# Altium project AnotherReprapController.PrjPcb
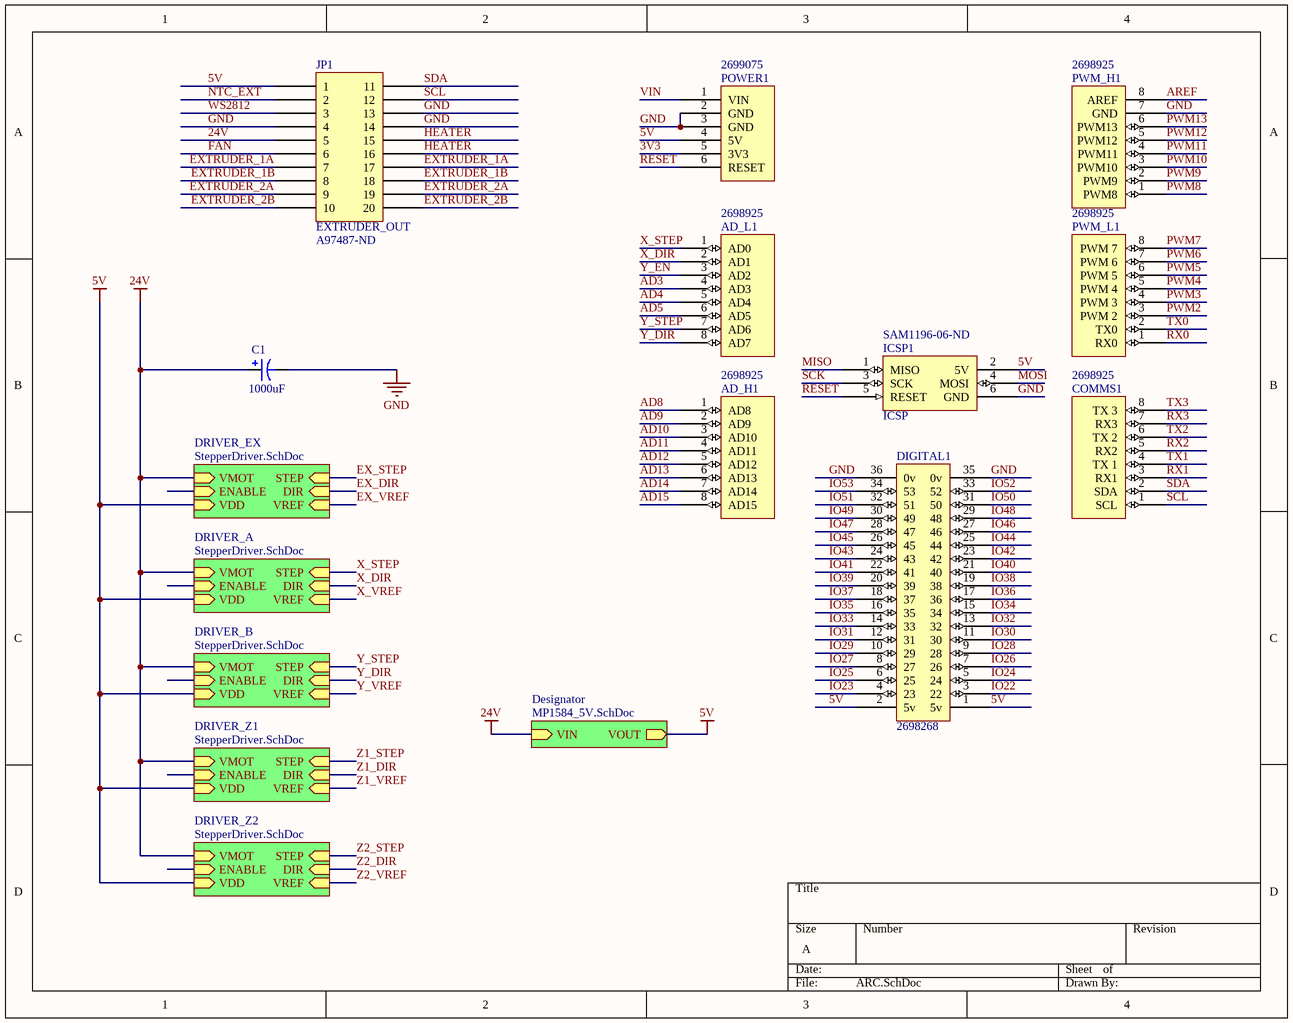
[diagram p0: ARC.SchDoc]
3 sheets, 47 parts. Net scope: hierarchical (ports join the sheet entries above them; power ports are global).
Board file: ARC.PcbDoc
Sheets:
  ARC.SchDoc
    DRIVER_EX = StepperDriver.SchDoc
    DRIVER_A = StepperDriver.SchDoc
    DRIVER_Z1 = StepperDriver.SchDoc
    DRIVER_B = StepperDriver.SchDoc
    DRIVER_Z2 = StepperDriver.SchDoc
    Designator = MP1584_5V.SchDoc

## Sheet ARC.SchDoc
size A

### Parts
AD_H1  Supplier Part Number 4: 2698925  [Header 8x1 8.5mm]  (hidden comment: AD_H)
AD_L1  Supplier Part Number 5: 2698925  [Header 8x1 8.5mm]  (hidden comment: AD_L)
C1  1000uF  [CAP_12.5mm]
COMMS1  Supplier Part Number 4: 2698925  [Header 8x1 8.5mm]  (hidden comment: Communication)
DIGITAL1  Supplier Part Number 5: 2698268  [HEADER 36X 8MM]  (hidden comment: IO_36)
ICSP1  ICSP  Supplier Part Number 5: SAM1196-06-ND  [ICSP]
JP1  EXTRUDER_OUT  Supplier Part Number 1: A97487-ND  [IDC20]
POWER1  Supplier Part Number 2: 2699075  [Header 6x1 8.5mm]  (hidden comment: POWER)
PWM_H1  Supplier Part Number 4: 2698925  [Header 8x1 8.5mm]  (hidden comment: PWM_H)
PWM_L1  Supplier Part Number 4: 2698925  [Header 8x1 8.5mm]  (hidden comment: PWM_L)

### Sub-sheets
Designator = MP1584_5V.SchDoc: VIN (in), VOUT (out)
DRIVER_A = StepperDriver.SchDoc: VMOT (in), VDD (in), STEP (in), DIR (in), VREF (in), ENABLE (in)
DRIVER_B = StepperDriver.SchDoc: VMOT (in), VDD (in), STEP (in), DIR (in), VREF (in), ENABLE (in)
DRIVER_EX = StepperDriver.SchDoc: VMOT (in), VDD (in), STEP (in), DIR (in), VREF (in), ENABLE (in)
DRIVER_Z1 = StepperDriver.SchDoc: VMOT (in), VDD (in), STEP (in), DIR (in), VREF (in), ENABLE (in)
DRIVER_Z2 = StepperDriver.SchDoc: VMOT (in), VDD (in), STEP (in), DIR (in), VREF (in), ENABLE (in)

### Nets
5V: DIGITAL1.1(5v) DIGITAL1.2(5v) ICSP1.2(5V) JP1.1 POWER1.4(5V) ; sheet DRIVER_EX/VDD, sheet DRIVER_A/VDD, sheet DRIVER_Z1/VDD, sheet DRIVER_B/VDD, sheet DRIVER_Z2/VDD, sheet Designator/VOUT
24V: C1.0 JP1.5 ; sheet DRIVER_EX/VMOT, sheet DRIVER_A/VMOT, sheet DRIVER_Z1/VMOT, sheet DRIVER_B/VMOT, sheet DRIVER_Z2/VMOT, sheet Designator/VIN
GND: C1.1 DIGITAL1.35(0v) DIGITAL1.36(0v) ICSP1.6(GND) JP1.4 JP1.13 JP1.14 POWER1.2(GND) POWER1.3(GND) PWM_H1.7(GND)
3V3: POWER1.5(3V3)
AD3: AD_L1.4(AD3)
AD4: AD_L1.5(AD4)
AD5: AD_L1.6(AD5)
AD8: AD_H1.1(AD8)
AD9: AD_H1.2(AD9)
AD10: AD_H1.3(AD10)
AD11: AD_H1.4(AD11)
AD12: AD_H1.5(AD12)
AD13: AD_H1.6(AD13)
AD14: AD_H1.7(AD14)
AD15: AD_H1.8(AD15)
AREF: PWM_H1.8(AREF)
EXTRUDER_1A: JP1.7 JP1.17
EXTRUDER_1B: JP1.8 JP1.18
EXTRUDER_2A: JP1.9 JP1.19
EXTRUDER_2B: JP1.10 JP1.20
FAN: JP1.6
HEATER: JP1.15 JP1.16
IO22: DIGITAL1.3(22)
IO23: DIGITAL1.4(23)
IO24: DIGITAL1.5(24)
IO25: DIGITAL1.6(25)
IO26: DIGITAL1.7(26)
IO27: DIGITAL1.8(27)
IO28: DIGITAL1.9(28)
IO29: DIGITAL1.10(29)
IO30: DIGITAL1.11(30)
IO31: DIGITAL1.12(31)
IO32: DIGITAL1.13(32)
IO33: DIGITAL1.14(33)
IO34: DIGITAL1.15(34)
IO35: DIGITAL1.16(35)
IO36: DIGITAL1.17(36)
IO37: DIGITAL1.18(37)
IO38: DIGITAL1.19(38)
IO39: DIGITAL1.20(39)
IO40: DIGITAL1.21(40)
IO41: DIGITAL1.22(41)
IO42: DIGITAL1.23(42)
IO43: DIGITAL1.24(43)
IO44: DIGITAL1.25(44)
IO45: DIGITAL1.26(45)
IO46: DIGITAL1.27(46)
IO47: DIGITAL1.28(47)
IO48: DIGITAL1.29(48)
IO49: DIGITAL1.30(49)
IO50: DIGITAL1.31(50)
IO51: DIGITAL1.32(51)
IO52: DIGITAL1.33(52)
IO53: DIGITAL1.34(53)
MISO: ICSP1.1(MISO)
MOSI: ICSP1.4(MOSI)
NTC_EXT: JP1.2
PWM2: PWM_L1.3(PWM_2)
PWM3: PWM_L1.4(PWM_3)
PWM4: PWM_L1.5(PWM_4)
PWM5: PWM_L1.6(PWM_5)
PWM6: PWM_L1.7(PWM_6)
PWM7: PWM_L1.8(PWM_7)
PWM8: PWM_H1.1(PWM8)
PWM9: PWM_H1.2(PWM9)
PWM10: PWM_H1.3(PWM10)
PWM11: PWM_H1.4(PWM11)
PWM12: PWM_H1.5(PWM12)
PWM13: PWM_H1.6(PWM13)
RESET: ICSP1.5(RESET) POWER1.6(RESET)
RX0: PWM_L1.1(RX0)
RX1: COMMS1.3(RX1)
RX2: COMMS1.5(RX2)
RX3: COMMS1.7(RX3)
SCK: ICSP1.3(SCK)
SCL: COMMS1.1(SCL) JP1.12
SDA: COMMS1.2(SDA) JP1.11
TX0: PWM_L1.2(TX0)
TX1: COMMS1.4(TX_1)
TX2: COMMS1.6(TX_2)
TX3: COMMS1.8(TX_3)
VIN: POWER1.1(VIN)
WS2812: JP1.3
X_DIR: AD_L1.2(AD1) ; sheet DRIVER_A/DIR
X_STEP: AD_L1.1(AD0) ; sheet DRIVER_A/STEP
Y_DIR: AD_L1.8(AD7) ; sheet DRIVER_B/DIR
Y_EN: AD_L1.3(AD2)
Y_STEP: AD_L1.7(AD6) ; sheet DRIVER_B/STEP

### Library data of the parts
C1 = CAP_12.5MM_GENERIC: Generic electrolytic capacitor w/ 12.5mm diameter and 5mm pitch
JP1 = IDC20: Supplier 1: Digi-Key
AD_H1 = AD_H: Supplier 1: Arrow; Supplier Part Number 1: 2698940; Supplier 2: Arrow; Supplier Part Number 2: 2698939; Supplier 3: Digi-Key; Supplier Part Number 3: SAM1198-08-ND; Supplier 4: Arrow
AD_L1 = AD_L: Supplier 1: Digi-Key; Supplier Part Number 1: SAM1198-08-ND; Supplier 2: Arrow; Supplier Part Number 2: 2698939; Supplier 3: Arrow; Supplier Part Number 3: 2698940; Supplier 4: Arrow; Supplier Part Number 4: 43085273; Supplier 5: Arrow
COMMS1 = Communication: Supplier 1: Digi-Key; Supplier Part Number 1: SAM1198-08-ND; Supplier 2: Arrow; Supplier Part Number 2: 2698940; Supplier 3: Arrow; Supplier Part Number 3: 2698939; Supplier 4: Arrow
DIGITAL1 = IO_36: Supplier 1: Digi-Key; Supplier Part Number 1: SAM1196-18-ND; Supplier 2: Arrow; Supplier Part Number 2: 48117090; Supplier 3: Arrow; Supplier Part Number 3: 46093326; Supplier 4: Arrow; Supplier Part Number 4: 2698278; Supplier 5: Arrow
ICSP1 = ICSP: Supplier 1: Digi-Key; Supplier Part Number 1: SAM1185-06-ND; Supplier 2: Arrow; Supplier Part Number 2: 2699117; Supplier 3: Arrow; Supplier Part Number 3: 43862781; Supplier 4: Arrow; Supplier Part Number 4: 2699091; Supplier 5: Digi-Key
POWER1 = POWER: Supplier 1: Arrow; Supplier Part Number 1: 52553843; Supplier 2: Arrow; Supplier 3: Digi-Key; Supplier Part Number 3: SAM1198-06-ND; Supplier 4: Arrow; Supplier Part Number 4: 2699089; Supplier 5: Arrow; Supplier Part Number 5: 2699088
PWM_H1 = PWM_H: Supplier 1: Digi-Key; Supplier Part Number 1: SAM1198-08-ND; Supplier 2: Arrow; Supplier Part Number 2: 2698940; Supplier 3: Arrow; Supplier Part Number 3: 2698939; Supplier 4: Arrow
PWM_L1 = PWM_L: Supplier 1: Arrow; Supplier Part Number 1: 2698940; Supplier 2: Arrow; Supplier Part Number 2: 2698939; Supplier 3: Digi-Key; Supplier Part Number 3: SAM1198-08-ND; Supplier 4: Arrow

## Sheet StepperDriver.SchDoc
size A
Used 5 times, as channels DRIVER_EX, DRIVER_A, DRIVER_Z1, DRIVER_B, DRIVER_Z2. Parts and nets are listed once, with the designators drawn on the sheet.
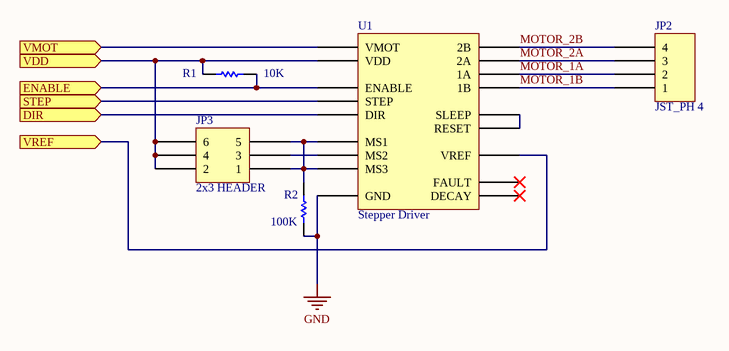
[diagram p1: StepperDriver.SchDoc]

### Parts
JP2  JST_PH 4  [JST_PH 4]
JP3  2x3 HEADER  [2x3 HEADER]
R1  10K  [RESC0603(1608)_N]
R2  100K  [RESC0603(1608)_N]
U1  Stepper Driver  [SureStepr]

### Ports
DIR (in), ENABLE (in), STEP (in), VDD (in), VMOT (in), VREF (in)

### Nets
GND: R2.1 U1.GND
DIR: U1.DIR ; port DIR
ENABLE: R1.1 U1.ENABLE ; port ENABLE
MOTOR_1A: JP2.2 U1.1A
MOTOR_1B: JP2.1 U1.1B
MOTOR_2A: JP2.3 U1.2A
MOTOR_2B: JP2.4 U1.2B
STEP: U1.STEP ; port STEP
VDD: JP3.2 JP3.4 JP3.6 R1.2 U1.VDD ; port VDD
VMOT: U1.VMOT ; port VMOT
VREF: U1.VREF ; port VREF
NetJP3_1: JP3.1 JP3.5 R2.2 U1.MS1 U1.MS3
NetJP3_3: JP3.3 U1.MS2
NetU1_RESET: U1.RESET U1.SLEEP

Not connected (* = marked no-connect by the designer): U1 DECAY* FAULT*

### Channels
DRIVER_EX: designators JP2=JP3_DRIVER_EX JP3=JP2_DRIVER_EX R1=R1_DRIVER_EX R2=R2_DRIVER_EX U1=U1_DRIVER_EX; ports DIR=EX_DIR ENABLE=NetR1_DRIVER_EX_1 STEP=EX_STEP VDD=5V VMOT=24V VREF=EX_VREF
DRIVER_A: designators JP2=JP3_DRIVER_A JP3=JP2_DRIVER_A R1=R1_DRIVER_A R2=R2_DRIVER_A U1=U1_DRIVER_A; ports DIR=X_DIR ENABLE=NetR1_DRIVER_A_1 STEP=X_STEP VDD=5V VMOT=24V VREF=X_VREF
DRIVER_Z1: designators JP2=JP3_DRIVER_Z1 JP3=JP2_DRIVER_Z1 R1=R1_DRIVER_Z1 R2=R2_DRIVER_Z1 U1=U1_DRIVER_Z1; ports DIR=Z1_DIR ENABLE=NetR1_DRIVER_Z1_1 STEP=Z1_STEP VDD=5V VMOT=24V VREF=Z1_VREF
DRIVER_B: designators JP2=JP3_DRIVER_B JP3=JP2_DRIVER_B R1=R1_DRIVER_B R2=R2_DRIVER_B U1=U1_DRIVER_B; ports DIR=Y_DIR ENABLE=NetR1_DRIVER_B_1 STEP=Y_STEP VDD=5V VMOT=24V VREF=Y_VREF
DRIVER_Z2: designators JP2=JP3_DRIVER_Z2 JP3=JP2_DRIVER_Z2 R1=R1_DRIVER_Z2 R2=R2_DRIVER_Z2 U1=U1_DRIVER_Z2; ports DIR=Z2_DIR ENABLE=NetR1_DRIVER_Z2_1 STEP=Z2_STEP VDD=5V VMOT=24V VREF=Z2_VREF

### Library data of the parts
R1 = CMP-1012-00098-1: 10K 0.1W 5% 0603 (1608 Metric)  SMD; Case-EIA: 0603; Value: 10000.00 Ohm; Case-Metric: 1608; Technology: SMT; Tolerance: 5 %; Power: 0.1 W
R2 = CMP-1012-00122-1: 100K 0.1W 5% 0603 (1608 Metric)  SMD; Case-EIA: 0603; Value: 100000.00 Ohm; Case-Metric: 1608; Tolerance: 5 %; Power: 0.1 W; Technology: SMT

## Sheet MP1584_5V.SchDoc
size A
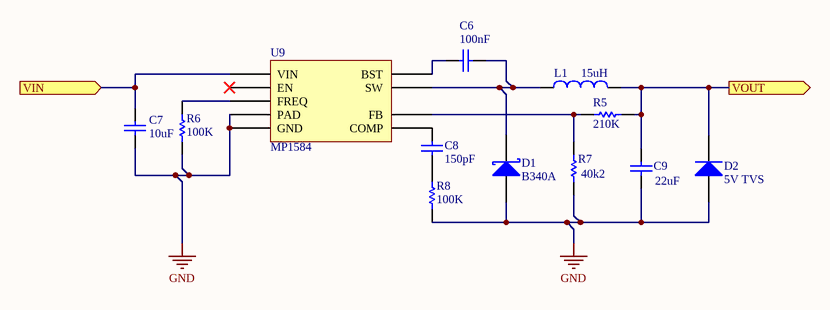
[diagram p2: MP1584_5V.SchDoc]

### Parts
C6  100nF  [CAPC0603(1608)100_L]
C7  10uF  [CAPC1210(3225)280_L]
C8  150pF  [CAPC0603(1608)100_L]
C9  22uF  [CAPC1210(3225)170_L]
D1  B340A  [DIOD-SMA-2_V]
D2  5V TVS  [VISH-DO-214AC-2_M]
L1  value 15uH  [0630 Inductor]  (hidden comment: 0630 Inductor)
R5  210K  [RESC0603(1608)_L]
R6  100K  [RESC0603(1608)_L]
R7  40k2  [RESC0603(1608)_L]
R8  100K  [RESC0603(1608)_L]
U9  MP1584  [SOIC8E]

### Ports
VIN (in), VOUT (out)

### Nets
5V: C9.2 D2.1(K) L1.2 R5.2 ; port VOUT
24V: C7.2 U9.7(VIN) ; port VIN
GND: C7.1 C9.1 D1.1(A) D2.2(A) R6.1 R7.1 R8.1 U9.5(GND) U9.9(PAD)
NetC6_1: C6.1 U9.8(BST)
NetC6_2: C6.2 D1.2(K) L1.1 U9.1(SW)
NetC8_1: C8.1 R8.2
NetC8_2: C8.2 U9.3(COMP)
NetR5_1: R5.1 R7.2 U9.4(FB)
NetR6_2: R6.2 U9.6(FREQ)

Not connected (* = marked no-connect by the designer): U9 2(EN)*

### Library data of the parts
C6 = CMP-1035-02591-1: CAP 100nF 50V ±5% 0603 (1608 Metric) Thickness 1mm SMD; Tolerance: Â±5%; Case-Metric: 1608; Case-EIA: 0603; Rated Voltage: 50 V; Max Thickness: 1 mm; Technology: SMT; Value: 100nF
C7 = CMP-1038-02234-1: CAP 10uF 35V ±10% 1210 (3225 Metric) Thickness 2.8mm SMD; Case-Metric: 3225; Case-EIA: 1210; Tolerance: Â±10%; Rated Voltage: 35 V; Value: 10uF; Max Thickness: 2.8 mm; Technology: SMT
C8 = CMP-1035-01367-1: CAP 150pF 50V ±5% 0603 (1608 Metric) Thickness 1mm SMD; Case-Metric: 1608; Tolerance: Â±5%; Case-EIA: 0603; Technology: SMT; Rated Voltage: 50 V; Value: 150pF; Max Thickness: 1 mm
C9 = CMP-1038-02258-1: CAP 22uF 6.3V ±10% 1210 (3225 Metric) Thickness 1.7mm SMD; Case-Metric: 3225; Tolerance: Â±10%; Case-EIA: 1210; Value: 22uF; Rated Voltage: 6.3 V; Technology: SMT; Max Thickness: 1.7 mm
D1 = CMP-1667-00003-1: Surface Mount Schottky Barrier Rectifier, 40 V, 3 A, -55 to 150 degC, 2-Pin SMA, RoHS, Tape and Reel; Forward Current: 3 A; Forward Voltage: 500 mV; Max Surge Current: 80 A; Peak Reverse Current: 500 uA; Elements: 1; Mounting Technology: Surface Mount; ComponentLink1URL: http://www.diodes.com/; PackageDescription: 2-Pin Surface Mounted Assembly, Body 4.3 x 2.605 mm, Height 2.4 mm; Min Operating Temperature: -55 degC; Mount: Surface Mount; Pins: 2; ComponentLink2URL: http://www.diodes.com/_files/datasheets/ds30891.pdf; PackageReference: SMA-2; Max Operating Temperature: 125 degC; Radiation Hardening: No; Length: 4.6 mm; RoHSCompliant: true; ComponentLink1Description: Manufacturer URL; Height: 2.1 mm; ComponentLink2Description: Datasheet; Packaging: Tape and Reel; Package Quantity: 5000; Case\Package: SMA; DatasheetVersion: Rev. 17 - 2, 09/2015; REACH SVHC: No SVHC; Width: 2.92 mm
D2 = CMP-0548-00062-2: Transient Voltage Suppressor, 6.40 to 231 V, 5 V Stand-off Voltage, Uni-Directional, -55 to 155 degC, 2-pin DO-214AC, Pb-Free, Tape and Reel; Manufacturer: Vishay Semiconductor; PartNumber: SMAJ5.0AHE3/61; ID (uA): 800; VBR Uni-Directional (V): 6.4 to 231; IFSM: 40 A; VWM (V): 5; PPPM (W): 400, 300; DatasheetVersion: 12/8/2013; ComponentLink3URL: http://www.vishay.com/docs/88390/smaj50a.pdf; ComponentLink2URL: http://www.vishay.com/docs/88390/smaj50a.pdf; PackageDescription: 2-Pin DO-214AC (SMA), Body 4.245 x 2.665 mm; ComponentLink3Description: Package Specification; RoHS: TRUE; Operating Junction and Storage Temperature Range: -55 to 150 degC; ComponentLink2Description: Datasheet; Mounting Technology: Surface Mount; Packing: Tape and Reel; PackageReference: DO-214AC-2; ComponentLink1Description: Manufacturer URL; ComponentLink1URL: http://www.vishay.com/
L1 = PCC-M0630M: Code_IEC: 1005; Published: 8-Jun-2000; LatestRevisionDate: 29-May-2009; LatestRevisionNote: IPC-7351 Footprint Added.; PackageReference: 0402-A; Publisher: Altium Limited; PackageDescription: Chip Inductor; Code_JEITA: 0402
R5 = CMP-1012-00770-1: 210K 0.1W 1% 0603 (1608 Metric)  SMD; Case-Metric: 1608; Value: 210000.00 Ohm; Case-EIA: 0603; Technology: SMT; Power: 0.1 W; Tolerance: 1 %
R6 R8 = CMP-1012-00122-1: as R2 on sheet StepperDriver; Tolerance: 5 %; Power: 0.1 W; Technology: SMT
R7 = CMP-1012-00691-1: 40K2 0.1W 1% 0603 (1608 Metric)  SMD; Case-Metric: 1608; Value: 40200.00 Ohm; Case-EIA: 0603; Tolerance: 1 %; Technology: SMT; Power: 0.1 W
U9 = MP1584: MP1584 3A, 1.5MHz, 28V Step-Down Converter

## Nets that join several sheets
5V: ARC (5 pins), DRIVER_EX (5 pins), DRIVER_A (5 pins), DRIVER_Z1 (5 pins), DRIVER_B (5 pins), DRIVER_Z2 (5 pins), MP1584_5V (C9.2 D2.1 L1.2 R5.2)
24V: ARC (C1.0 JP1.5), DRIVER_EX (U1_DRIVER_EX.VMOT), DRIVER_A (U1_DRIVER_A.VMOT), DRIVER_Z1 (U1_DRIVER_Z1.VMOT), DRIVER_B (U1_DRIVER_B.VMOT), DRIVER_Z2 (U1_DRIVER_Z2.VMOT), MP1584_5V (C7.2 U9.7)
GND: ARC (10 pins), DRIVER_EX (R2_DRIVER_EX.1 U1_DRIVER_EX.GND), DRIVER_A (R2_DRIVER_A.1 U1_DRIVER_A.GND), DRIVER_Z1 (R2_DRIVER_Z1.1 U1_DRIVER_Z1.GND), DRIVER_B (R2_DRIVER_B.1 U1_DRIVER_B.GND), DRIVER_Z2 (R2_DRIVER_Z2.1 U1_DRIVER_Z2.GND), MP1584_5V (9 pins)
X_DIR: ARC (AD_L1.2), DRIVER_A (U1_DRIVER_A.DIR)
X_STEP: ARC (AD_L1.1), DRIVER_A (U1_DRIVER_A.STEP)
Y_DIR: ARC (AD_L1.8), DRIVER_B (U1_DRIVER_B.DIR)
Y_STEP: ARC (AD_L1.7), DRIVER_B (U1_DRIVER_B.STEP)